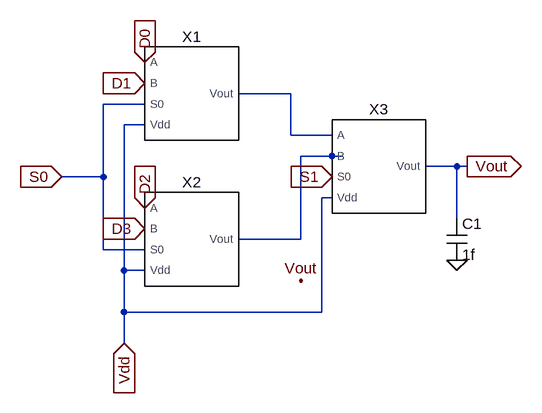
[diagram p0: schematic mux4.asc]
mux4.asc, the LTspice schematic file:
Version 4.1
SHEET 1 912 680
WIRE 528 -48 448 -48
WIRE 304 -32 240 -32
WIRE 304 0 272 0
WIRE 528 16 528 -48
WIRE 592 16 528 16
WIRE 592 48 544 48
WIRE 608 48 592 48
WIRE 784 64 736 64
WIRE 800 64 784 64
WIRE 240 80 240 -32
WIRE 240 80 176 80
WIRE 592 112 576 112
WIRE 784 144 784 64
WIRE 544 176 544 48
WIRE 544 176 448 176
WIRE 240 192 240 80
WIRE 304 192 240 192
WIRE 272 224 272 0
WIRE 304 224 272 224
WIRE 272 288 272 224
WIRE 576 288 576 112
WIRE 576 288 272 288
WIRE 272 336 272 288
FLAG 176 80 S0
IOPIN 176 80 In
FLAG 592 80 S1
IOPIN 592 80 In
FLAG 544 240 Vout
FLAG 800 64 Vout
IOPIN 800 64 Out
FLAG 304 -96 D0
IOPIN 304 -96 In
FLAG 304 -64 D1
IOPIN 304 -64 In
FLAG 304 128 D2
IOPIN 304 128 In
FLAG 304 160 D3
IOPIN 304 160 In
FLAG 784 208 0
FLAG 272 336 Vdd
IOPIN 272 336 In
SYMBOL mux 368 -48 R0
SYMATTR InstName X1
SYMBOL mux 368 176 R0
SYMATTR InstName X2
SYMBOL mux 656 64 R0
SYMATTR InstName X3
SYMBOL cap 768 144 R0
SYMATTR InstName C1
SYMATTR Value 1f

The netlist it stands for:
* mux4.asc
X§X1 D0 D1 S0 Vdd N001 mux  ; pins A B S0 Vdd Vout
X§X2 D2 D3 S0 Vdd N002 mux  ; pins A B S0 Vdd Vout
X§X3 N001 N002 S1 Vdd Vout mux  ; pins A B S0 Vdd Vout
C1 Vout 0 1f
.backanno
.end